# Altium schematic sheet schematic.SchDoc
size A4; SheetNumber: 1; SheetTotal: 1
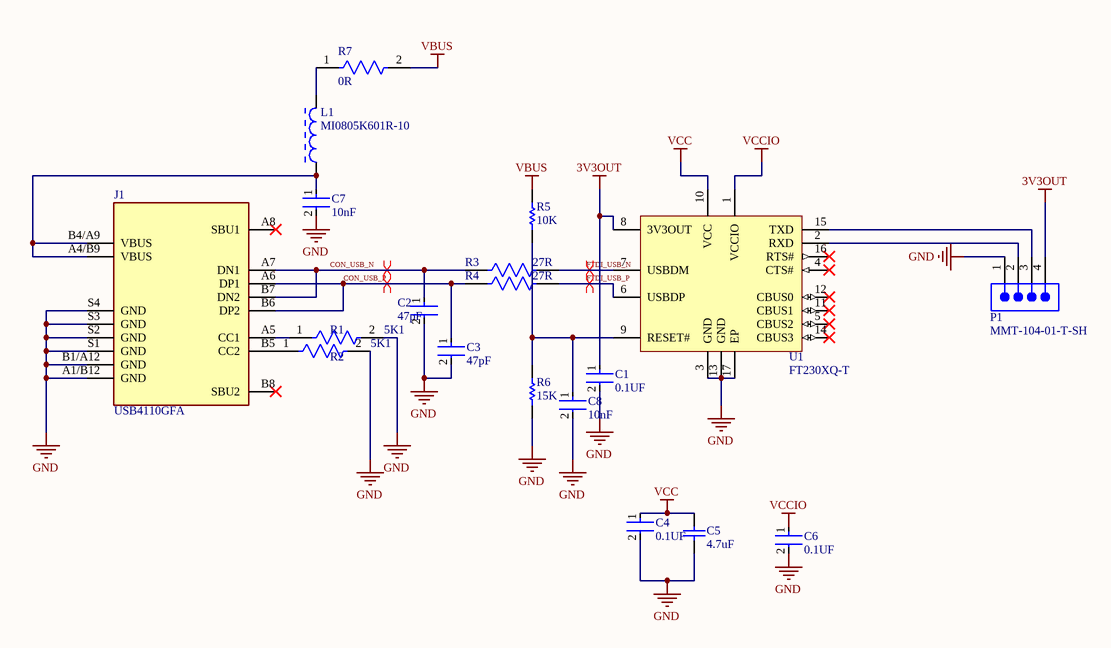
[diagram p0: schematic.SchDoc]

## Parts
C1  0.1UF  [FP-C0402-BB-MFG]
C2  47pF  [FP-C0402-BB-MFG]
C3  47pF  [FP-C0402-BB-MFG]
C4  0.1UF  [FP-C0402-BB-MFG]
C5  4.7uF  [CAPC2013X145X50ML20T25]
C6  0.1UF  [FP-C0402-BB-MFG]
C7  10nF  [FP-C0402-BB-MFG]
C8  10nF  [FP-C0402-BB-MFG]
J1  USB4110GFA  [GCT_USB4110GFA]
L1  MI0805K601R-10  [LIRD-MI0805K601R-10-2_V]
P1  MMT-104-01-T-SH  [SMTC-MMT-104-01-X-SH]
R1  5K1  [FP-CRCW0402-e3-IPC_A]
R2  5K1  [FP-CRCW0402-e3-IPC_A]
R3  27R  [FP-AC0402-MFG]
R4  27R  [FP-AC0402-MFG]
R5  10K  [RESC1005X40X20NL05T10]
R6  15K  [RESC1005X40X20NL05T10]
R7  0R  [FP-AF1206-MFG]
U1  FT230XQ-T  [QFN-16_M]

## Nets
3V3OUT: C1.1 P1.4 U1.8(3V3OUT)
GND: C1.2 C2.2 C3.2 C4.2 C5.1 C6.2 C7.2 C8.2 J1.A1/B12(GND) J1.B1/A12(GND) J1.S1(GND) J1.S2(GND) J1.S3(GND) J1.S4(GND) P1.1 R1.2 R2.2 R6.2 U1.3(GND) U1.13(GND) U1.17(EP)
VBUS: R5.1 R7.2
VCC: C4.1 C5.2 U1.10(VCC)
VCCIO: C6.1 U1.1(VCCIO)
CON_USB_N: C2.1 J1.A7(DN1) J1.B7(DN2) R3.1
CON_USB_P: C3.1 J1.A6(DP1) J1.B6(DP2) R4.1
FTDI_USB_N: R3.2 U1.7(USBDM)
FTDI_USB_P: R4.2 U1.6(USBDP)
NetC7_1: C7.1 J1.A4/B9(VBUS) J1.B4/A9(VBUS) L1.1
NetC8_1: C8.1 R5.2 R6.1 U1.9(RESET#)
NetJ1_A5: J1.A5(CC1) R1.1
NetJ1_B5: J1.B5(CC2) R2.1
NetL1_2: L1.2 R7.1
NetP1_2: P1.2 U1.2(RXD)
NetP1_3: P1.3 U1.15(TXD)

Not connected (* = marked no-connect by the designer): J1 A8(SBU1)* B8(SBU2)*; U1 4(CTS#)* 5(CBUS2)* 11(CBUS1)* 12(CBUS0)* 14(CBUS3)* 16(RTS#)*

## Layout directives
differential pair: CON_USB_N, CON_USB_P, FTDI_USB_N, FTDI_USB_P

## Library data of the parts
C1 C4 C6 = CMP-03020-014070-2: CAP CER 0.1UF 25V X5R 0402; Manufacturer: Kemet; Manufacturer Part Number: C0402C104M3PAC7867; Material: Ceramic; Tolerance: 0.2; Value: 0.10 μF; Temperature Coefficient: 15%; Height: 0.55mm; Category: Cap; Temperature: -55°C to +125°C; Automotive: No; Package: C0402-BB; Temperature Range Low: -55°C; ComponentLink2Description: Datasheet; Device Class L3: Ceramic Capacitors; ComponentLink2URL: https://content.kemet.com/datasheets/KEM_C1002_X7R_SMD.pdf; Octopart: https://octopart.com/c0402c104m3pac7867-kemet-84304880; Temperature Characteristic: X5R; RoHS: TRUE; Temperature Range High: +125°C; Device Class L1: Passive Components; Capacitance: 0.10 μF; Lead Free: Yes; Voltage Rating: 25 V; Ipc Land Pattern Name: CAPC10050X50; Device Class L2: Capacitors; Digikey Description: CAP CER 0.1UF 25V X5R 0402
C2 C3 = CMP-03020-019736-1: Cap Ceramic 47pF 25V X7R 5% Pad SMD 0402 125C Automotive T/R; Manufacturer: Kemet; Manufacturer Part Number: C0402C470J3RACAUTO; Temperature Coefficient: 15%; Tolerance: 0.05; Voltage Rating: 25 V; Category: Cap; Temperature Range High: +125°C; Temperature: -55°C to +125°C; Mouser Description: Cap Ceramic 47pF 25V X7R 5% Pad SMD 0402 125C Automotive T/R; Device Class L3: Ceramic Capacitors; Height: 0.55mm; ComponentLink2Description: Datasheet; Automotive: No; Temperature Characteristic: X7R; Octopart: https://octopart.com/c0402c470j3racauto-kemet-86584164; Device Class L2: Capacitors; Device Class L1: Passive Components; RoHS: TRUE; Temperature Range Low: -55°C; Value: 47 pF; Ipc Land Pattern Name: CAPC10050X50; Capacitance: 47 pF; Lead Free: Yes; Digikey Description: Cap Ceramic 47pF 25V X7R 5% Pad SMD 0402 125C Automotive T/R; Material: Ceramic; Package: C0402-BB; ComponentLink2URL: https://content.kemet.com/datasheets/KEM_C1002_X7R_SMD.pdf
C5 = CMP-1036-04891-3: Manufacturer: Kemet; Part Number: C0805C475M4PACTU
C7 C8 = CMP-03020-021286-1: C0402 10,000 pF X7R 10.00% 50 V; Manufacturer Part Number: C0402C103K5RAC; Manufacturer: Kemet; Temperature Coefficient: 15%; Material: Ceramic; Voltage Rating: 50 V; Tolerance: 0.1; Mouser Description: Cap Ceramic 0.01uF 50V X7R 10% Pad SMD 0402 125C Bulk; Device Class L3: Ceramic Capacitors; ComponentLink2Description: Datasheet; Ipc Land Pattern Name: CAPC10050X50; Capacitance: 10,000 pF; Category: Cap; Automotive: No; Temperature Characteristic: X7R; Value: 10,000 pF; Temperature Range High: +125°C; RoHS: TRUE; Octopart: https://octopart.com/c0402c103k5rac-kemet-7501684; Height: 0.55mm; ComponentLink2URL: https://content.kemet.com/datasheets/KEM_C1002_X7R_SMD.pdf; Temperature: -55°C to +125°C; Lead Free: Yes; Temperature Range Low: -55°C; Device Class L2: Capacitors; Device Class L1: Passive Components; Package: C0402-BB
J1 = USB4110GFA: USB-C (USB TYPE-C) USB 2.0 Receptacle Connector 24 (16+8 Dummy) Position Surface Mount, Right Angle; MF: Global Connector Technology; SnapEDA_Link: https://www.snapeda.com/parts/USB4110GFA/Global+Connector+Technology/view-part/?ref=snap; Package: None; Value: *; MP: USB4110GFA; Check_prices: https://www.snapeda.com/parts/USB4110GFA/Global+Connector+Technology/view-part/?ref=eda
L1 = CMP-2000-05196-1: Chip Bead for Power Filtering, 1500 mA, 600 Ohm, -40 to 125 degC, 0805 (2012 Metric), RoHS, Tape and Reel; Manufacturer: Laird; Filter Type: PowerLine; Current Rating (Max): 1.5A; Catalog Drawings: (HI,HZ,LI,MI)0805Series_1.10mmMax.Height; Impedance @ Frequency: 600Ohm@100MHz; Number of Lines: 1; DC Resistance (DCR) (Max): 100mOhm; Other Names: 240-2390-1; Kits: 240-2227-ND-KITEMIFERRITEBEADCHIPSMD; Online Catalog: MISeries; Standard Package: 1; Datasheet Version: Rev. A, 01/2004; Height (Max): 0.043"(1.10mm); Category: Filters; Operating Temperature: -40degC~125degC; Package Description: 2-Pin Surface Mount Device, Body 2 x 1.25 mm; Package / Case: 0805(2012Metric); Package Reference: MI0805K601R-10-2; Packaging: CutTape(CT); Ratings: -; Mounting Type: SurfaceMount; Datasheet URL: https://datasheet.ciiva.com/3082/mi0805k601r-10-a-vp-3082219.pdf; Size / Dimension: 0.079"Lx0.049"W(2.00mmx1.25mm); Family: FerriteBeadsandChips; Manufacturer URL: https://www.lairdtech.com; Series: MI
P1 = CMP-1029-00049-1: Horizontal Surface Mount Header, -55 to 105 degC, 2 mm Pitch, 4-Pin, Male, RoHS; Manufacturer: Samtec; Pitch: 2 mm; Orientation: Horizontal; RoHS: True; Mounting Technology: Surface Mount; PackageReference: MMT-104-01-X-SH; ComponentLink2URL: http://d2a072wq521u33.cloudfront.net/catalog_english//MMT_SM.PDF; Temperature Range: -55 to 105 degC; PartNumber: MMT-104-01-T-SH; ComponentLink1Description: Manufacturer URL; PackageVersion: CY, 12/2000; ComponentLink1URL: http://www.samtec.com; ComponentLink3Description: Package Specification; ComponentLink3URL: http://www.samtec.com/documents/webfiles/cpdf/MMT-1XX-XX-XX-XX-XX-XXX-X-XX-MKT.pdf; PackageDescription: 2mm Horizontal Terminal Surface Mount Strip ASSEM; DatasheetVersion: F-214; ComponentLink2Description: Datasheet
R1 R2 = CMP-02407-004842-1: RES Thick Film, 5.1kΩ, 5%, 0.063W, 200ppm/°C, 0402; Resistance: 5.1kR; Max Power Dissipation: 63mW; Number of Terminations: 2; Length: 0.039inch; Composition: Thick Film; Max Operating Temperature: 155°C; Min Operating Temperature: -55°C; Features: Automotive AEC-Q200; Width: 0.02inch; Lead Free: Lead Free; Case/Package: 0402; Temperature Coefficient: 200ppm/°C; Packaging: Tape and Reel; Height: 0.016inch; Package Quantity: 50000; Tolerance: 5%
R3 R4 = CMP-03412-042158-1: RES 27Ω ±5% 0.063W 0402; Temperature Coefficient: 100ppm/°C; Max Power Dissipation: 63mW; Resistance: 27R; Packaging: Tape and Reel; Resistor Type: Thick Film; Features: Moisture Resistant; Tolerance: 5%; Number of Terminations: 2; Width: 0.02inch; Min Operating Temperature: -55°C; Series: AC; Case/Package: 0402; RoHS Compliant: Yes; Height: 0.015inch; Length: 0.039inch; Max Operating Temperature: 155°C
R5 R6 = CMP-2002-01682-1: Manufacturer: Vishay BCcomponents; Part Number: TNPW040210K0DEED
R7 = CMP-03412-039834-1: Anti-Sulfurated Chip Resistor Automotive Grade 0Ω Jumper 0.25W 1206; Tolerance: 5%; Max Power Dissipation: 250mW; Height: 0.026inch; Series: AF; Max Operating Temperature: 155°C; Length: 0.122inch; Packaging: Tape and Reel; Number of Terminations: 2; Width: 0.063inch; Resistance: 0R; Features: Moisture Resistant; Resistor Type: Thick Film; RoHS Compliant: Yes; Min Operating Temperature: -55°C; Case/Package: 1206
U1 = CMP-0248-00009-2: USB to Basic UART Interface Chip, UHCI/OHCI/EHCI Compatible, USB 2.0 Compatible, -40 to +85 degC, 16-Pin QFN, Pb-Free, Tray; Manufacturer: FTDI; ComponentLink2Description: Datasheet; ComponentLink1Description: Manufacturer URL; ComponentLink3URL: www.ftdichip.com/Products/ICs/FT230X.html; ComponentLink1URL: http://www.ftdichip.com/; DatasheetVersion: ver 1.2, Feb-2013; Code_JEDEC: MO-220WGGC; ComponentLink2URL: http://www.ftdichip.com/Support/Documents/DataSheets/ICs/DS_FT230X.pdf; PackageVersion: Feb-13; PackageReference: QFN-16; PackageDescription: 16-Pin Quad Flat No-Lead, 4x4 mm Body, 0.65 mm Pitch; PartNumber: FT230XQ-T; RevisionNote: DatasheetVersion updated to 1.2 Feb-2013; ComponentLink3Description: FT230X Product Page